# EAGLE design PiDRO1 (EAGLE 6.5.0)
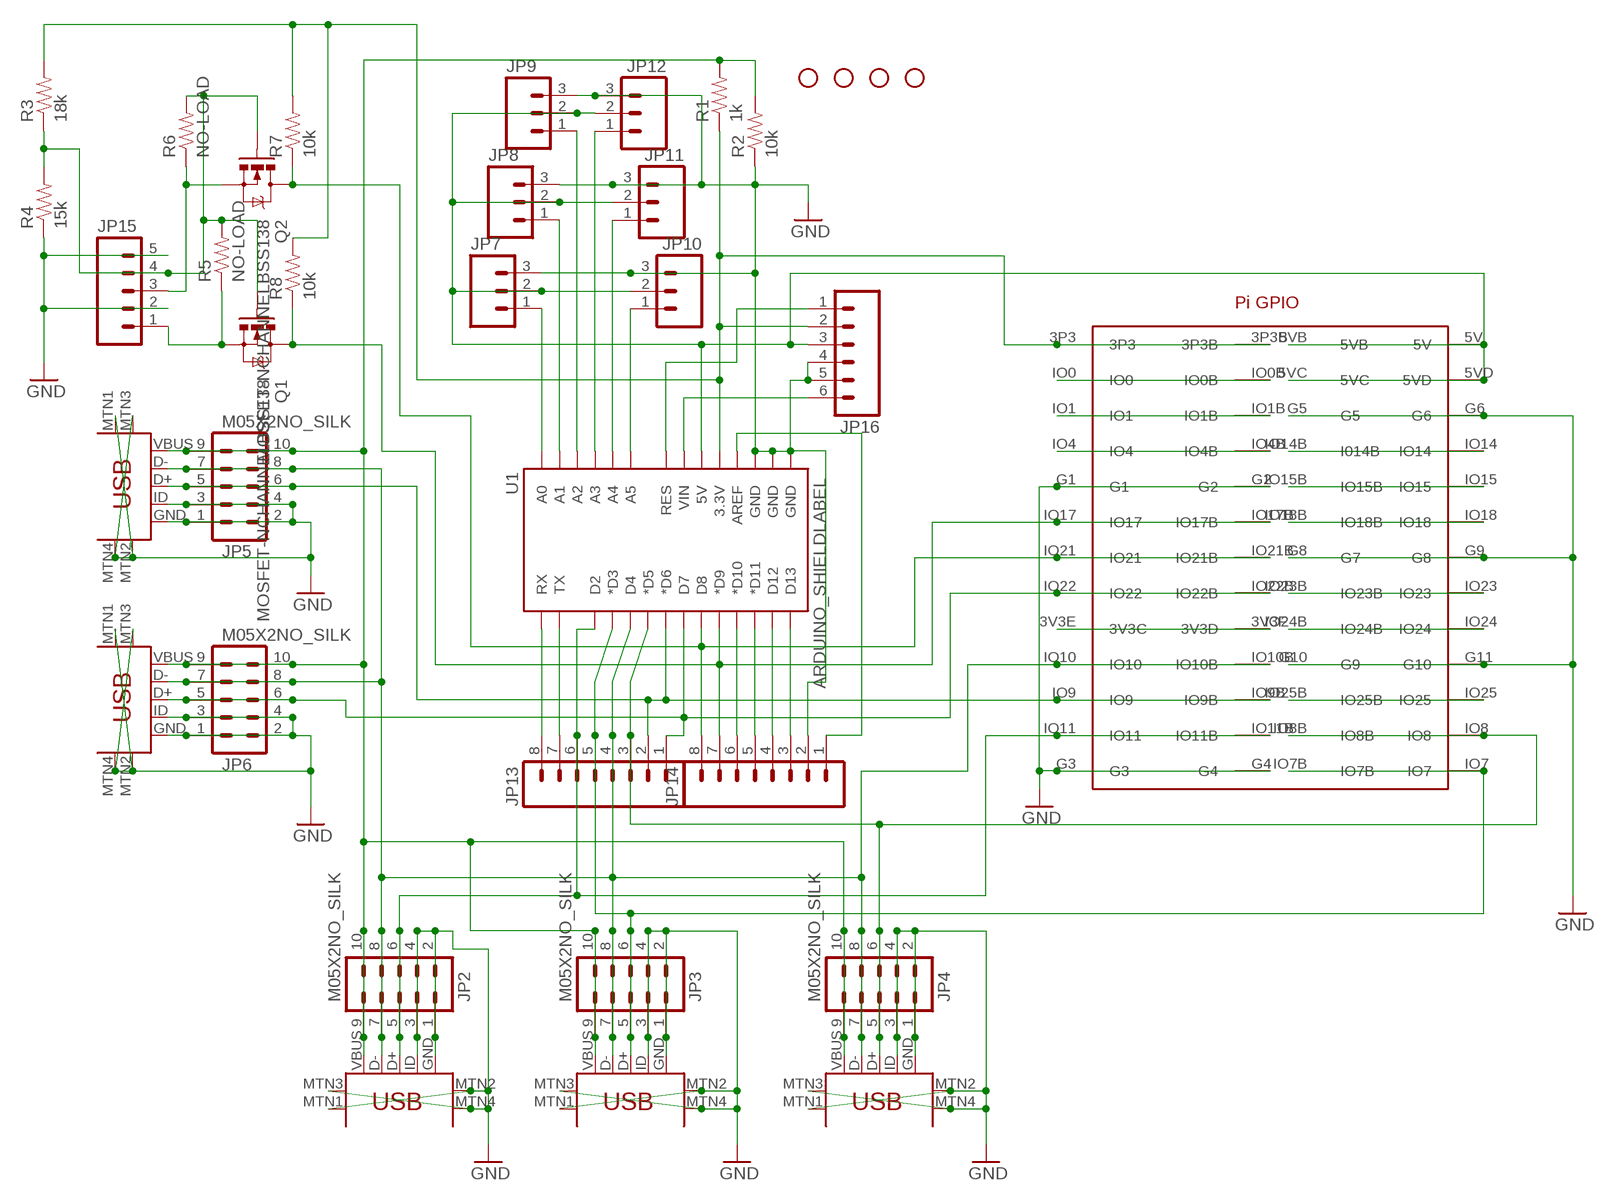
[diagram p0: schematic, sheet 1]

## Parts
JP2  M05X2NO_SILK  [2X5_NOSILK]
JP3  M05X2NO_SILK  [2X5_NOSILK]
JP4  M05X2NO_SILK  [2X5_NOSILK]
JP5  M05X2NO_SILK  [2X5_NOSILK]
JP6  M05X2NO_SILK  [2X5_NOSILK]
JP7  M03LOCK_NO_SILK  [1X03_LOCK_NO_SILK]
JP8  M03LOCK_NO_SILK  [1X03_LOCK_NO_SILK]
JP9  M03LOCK_NO_SILK  [1X03_LOCK_NO_SILK]
JP10  M03LOCK_NO_SILK  [1X03_LOCK_NO_SILK]
JP11  M03LOCK_NO_SILK  [1X03_LOCK_NO_SILK]
JP12  M03LOCK_NO_SILK  [1X03_LOCK_NO_SILK]
JP13  M08  [1X08_PIN1_NO_SILK]
JP14  M08  [1X08_PIN1_NO_SILK]
JP15  M05PTH  [1X05]
JP16  M06LOCK  [1X06_LOCK]
Q1  MOSFET-NCHANNELBSS138  [SOT23]
Q2  MOSFET-NCHANNELBSS138  [SOT23]
R1  1k  RESISTOR0805-RES  [0805]
R2  10k  RESISTOR0805-RES  [0805]
R3  18k  RESISTOR0805-RES  [0805]
R4  15k  RESISTOR0805-RES  [0805]
R5  NO-LOAD  RESISTOR0805-RES  [0805]
R6  NO-LOAD  RESISTOR0805-RES  [0805]
R7  10k  RESISTOR0805-RES  [0805]
R8  10k  RESISTOR0805-RES  [0805]
STANDOFF1  STAND-OFF  [STAND-OFF]
STANDOFF2  STAND-OFF  [STAND-OFF]
STANDOFF3  STAND-OFF  [STAND-OFF]
STANDOFF4  STAND-OFF  [STAND-OFF]
U1  ARDUINO_SHIELDLABEL  [DUEMILANOVE_SHIELD]
U$1  PIGPIO_2X  [PI_GPIO_2X]
U$2  USB-MINIB-5PIN  [USB-MINIB]
U$3  USB-MINIB-5PIN  [USB-MINIB]
U$4  USB-MINIB-5PIN  [USB-MINIB]
U$5  USB-MINIB-5PIN  [USB-MINIB]
U$6  USB-MINIB-5PIN  [USB-MINIB]

## Nets
GND: JP2.1 JP2.2 JP2.3 JP2.4 JP3.1 JP3.2 JP3.3 JP3.4 JP4.1 JP4.2 JP4.3 JP4.4 JP5.1 JP5.2 JP5.3 JP5.4 JP6.1 JP6.2 JP6.3 JP6.4 JP7.3 JP8.3 JP9.3 JP10.3 JP11.3 JP12.3 JP14.2 JP15.2 JP15.5 JP16.4 JP16.5 R2.1 R4.1 U1.GND@0(GND) U1.GND@1(GND) U1.GND@2(GND) U$1.G1 U$1.G2 U$1.G3 U$1.G4 U$1.G5 U$1.G6 U$1.G8(G7) U$1.G9(G8) U$1.G10(G9) U$1.G11(G10) U$2.GND U$2.ID U$2.MTN1(MTN2) U$2.MTN2(MTN3) U$2.MTN3(MTN1) U$2.MTN4 U$3.GND U$3.ID U$3.MTN1(MTN2) U$3.MTN2(MTN3) U$3.MTN3(MTN1) U$3.MTN4 U$4.GND U$4.ID U$4.MTN1(MTN2) U$4.MTN2(MTN3) U$4.MTN3(MTN1) U$4.MTN4 U$5.GND U$5.ID U$5.MTN1(MTN2) U$5.MTN2(MTN3) U$5.MTN3(MTN1) U$5.MTN4 U$6.GND U$6.ID U$6.MTN1(MTN2) U$6.MTN2(MTN3) U$6.MTN3(MTN1) U$6.MTN4
N$1: JP15.4 Q1.1(G) Q2.1(G) R3.1 R4.2 R5.2 R6.2
N$2: JP2.7 JP2.8 JP3.7 JP3.8 JP4.7 JP4.8 JP5.7 JP5.8 JP6.7 JP6.8 JP13.4 U1.D4 U$1.IO10 U$1.IO10B U$2.D- U$3.D- U$4.D- U$5.D- U$6.D-
N$3: JP2.5 JP2.6 JP13.6 U1.D2 U$1.IO11 U$1.IO11B U$2.D+
N$4: JP13.8 U1.RX
N$5: JP15.1 Q1.2(S) R5.1
N$6: JP15.3 Q2.2(S) R6.1
N$8: JP14.8 Q2.3(D) R7.1 U1.D8 U$1.IO21 U$1.IO21B
N$9: JP13.7 U1.TX
N$10: U$1.IO0 U$1.IO0B
N$11: JP14.7 Q1.3(D) R8.1 U1.D9(*D9) U$1.IO17 U$1.IO17B
N$12: JP11.1 U1.A4
N$13: U$1.IO1 U$1.IO1B
N$14: U$1.IO4 U$1.IO4B
N$19: U$1.3V3E(3V3C) U$1.3V3F(3V3D)
N$20: JP3.5 JP3.6 JP13.5 U1.D3(*D3) U$1.IO7 U$1.IO7B U$3.D+
N$21: JP2.9 JP2.10 JP3.9 JP3.10 JP4.9 JP4.10 JP5.9 JP5.10 JP6.9 JP6.10 R1.2 R2.2 U$2.VBUS U$3.VBUS U$4.VBUS U$5.VBUS U$6.VBUS
N$23: JP6.5 JP6.6 JP13.1 U1.D7 U$1.IO22 U$1.IO22B U$6.D+
N$26: JP4.5 JP4.6 JP13.3 U1.D5(*D5) U$1.IO8 U$1.IO8B U$4.D+
N$27: JP5.5 JP5.6 JP13.2 U1.D6(*D6) U$1.IO9 U$1.IO9B U$5.D+
N$29: JP14.3 U1.D13
N$30: JP14.4 U1.D12
N$31: JP14.5 U1.D11(*D11)
N$32: JP14.6 U1.D10(*D10)
N$35: U$1.IO25 U$1.IO25B
N$36: JP7.1 U1.A0
N$38: U$1.IO24 U$1.IO24B
N$39: JP8.1 U1.A1
N$40: U$1.IO23 U$1.IO23B
N$42: JP9.1 U1.A2
N$43: JP12.1 U1.A3
N$44: JP10.1 U1.A5
N$45: JP7.2 JP8.2 JP9.2 JP10.2 JP11.2 JP12.2 JP16.3 U1.5V U$1.5V U$1.5VB U$1.5VC U$1.5VD
N$46: JP16.2 R1.1 R3.2 R7.2 R8.2 U1.3.3V U$1.3P3 U$1.3P3B
N$47: U$1.IO18 U$1.IO18B
N$49: JP16.1 U1.RES
N$50: JP16.6 U1.VIN
N$51: JP14.1 U1.AREF
N$52: U$1.IO15 U$1.IO15B
N$53: U$1.IO14 U$1.IO14B(I014B)

## Library data of the parts
JP2-JP6 = SparkFun-Connectors:M05X2: Header 5x2 Standard 10-pin dual row 0.1" header. Commonly used with AVR-ISP. Use with Spark Fun Electronics SKU: PRT-00778
JP7-JP12 = SparkFun-Connectors:M03: Header 3 Standard 3-pin 0.1" header. Use with straight break away headers (SKU : PRT-00116), right angle break away headers (PRT-00553), swiss pins (PRT-00743), machine pins (PRT-00117), and female headers (PRT-00115). Molex polarized connector foot print use with SKU : PRT-08232 with associated crimp pins and housings.
JP13 JP14 = SparkFun-Connectors:M08: Header 8 Standard 8-pin 0.1" header. Use with straight break away headers (SKU : PRT-00116), right angle break away headers (PRT-00553), swiss pins (PRT-00743), machine pins (PRT-00117), and female headers (PRT-00115).
JP15 = SparkFun-Connectors:M05: Header 5 Standard 5-pin 0.1" header. Use with straight break away headers (SKU : PRT-00116), right angle break away headers (PRT-00553), swiss pins (PRT-00743), machine pins (PRT-00117), and female headers (PRT-00115). Molex polarized connector foot print use with SKU : PRT-08230 with associated crimp pins and housings.
JP16 = SparkFun-Connectors:M06: Header 6 Standard 6-pin 0.1" header. Use with straight break away headers (SKU : PRT-00116), right angle break away headers (PRT-00553), swiss pins (PRT-00743), machine pins (PRT-00117), and female headers (PRT-00115). Molex polarized connector foot print use with SKU : PRT-08094 with associated crimp pins and housings. NOTES ON THE VARIANTS LOCK and LOCK_LONGPADS... This footprint was designed to help hold the alignment of a through-hole component (i.e. 6-pin header) while soldering it into place. You may notice that each hole has been shifted either up or down by 0.005 of an inch from it's more standard position (which is a perfectly straight line). This slight alteration caused the pins (the squares in the middle) to touch the edges of the holes. Because they are alternating, it causes a "brace" to hold the component in place. 0.005 has proven to be the perfect amount of "off-center" position when using our standard breakaway headers. Although looks a little odd when you look at the bare footprint, once you have a header in there, the alteration is very hard to notice. Also,if you push a header all the way into place, it is covered up entirely on the bottom side. This idea of altering the position of holes to aid alignment will be further integrated into the Sparkfun Library for other footprints. It can help hold any component with 3 or more connection pins.
Q1 Q2 = SparkFun-DiscreteSemi:MOSFET-NCHANNEL: Common NMOSFET Parts MFG P/N Store ID Prod ID FDD8780 TRANS-09984 SI7820DN TRANS-11055 FDS6630A IC-08089 2N7002PW TRANS-11151 FQP30N06L COM-10213 TRANS-10060 BSS123LT1G TRANS-08345 BSS138 TRANS-00830 BS170 2N7000; PROD_ID: TRANS-00830
R1-R8 = SparkFun-Passives:RESISTOR: Resistor Basic schematic elements and footprints for 0603, 1206, and PTH resistors.
STANDOFF1-STANDOFF4 = SparkFun-Electromechanical:STAND-OFF: #4 Stand Off This is the mechanical footprint for a #4 phillips button head screw. Use the keepout ring to avoid running the screw head into surrounding components. SKU : PRT-00447
U1 = SparkFun-Boards:ARDUINO_SHIELD: Arduino shield footprint
U$1 = abc_alan:PIGPIO_2X
U$2-U$6 = SparkFun-Connectors:USB-MINIB: Mini-USB "B" connector with 5th pin broken out. Created new symbol breaking out 5th "ID" pin in mini/micro USB connector spec. See: http://en.wikipedia.org/wiki/Mini_usb#Cables. Uses same footprint as 4-pin symbol. Also added pins to connect to mounting / shield pads if required (probably not generally needed as signals aren't shielded once they leave the connector).

## Board
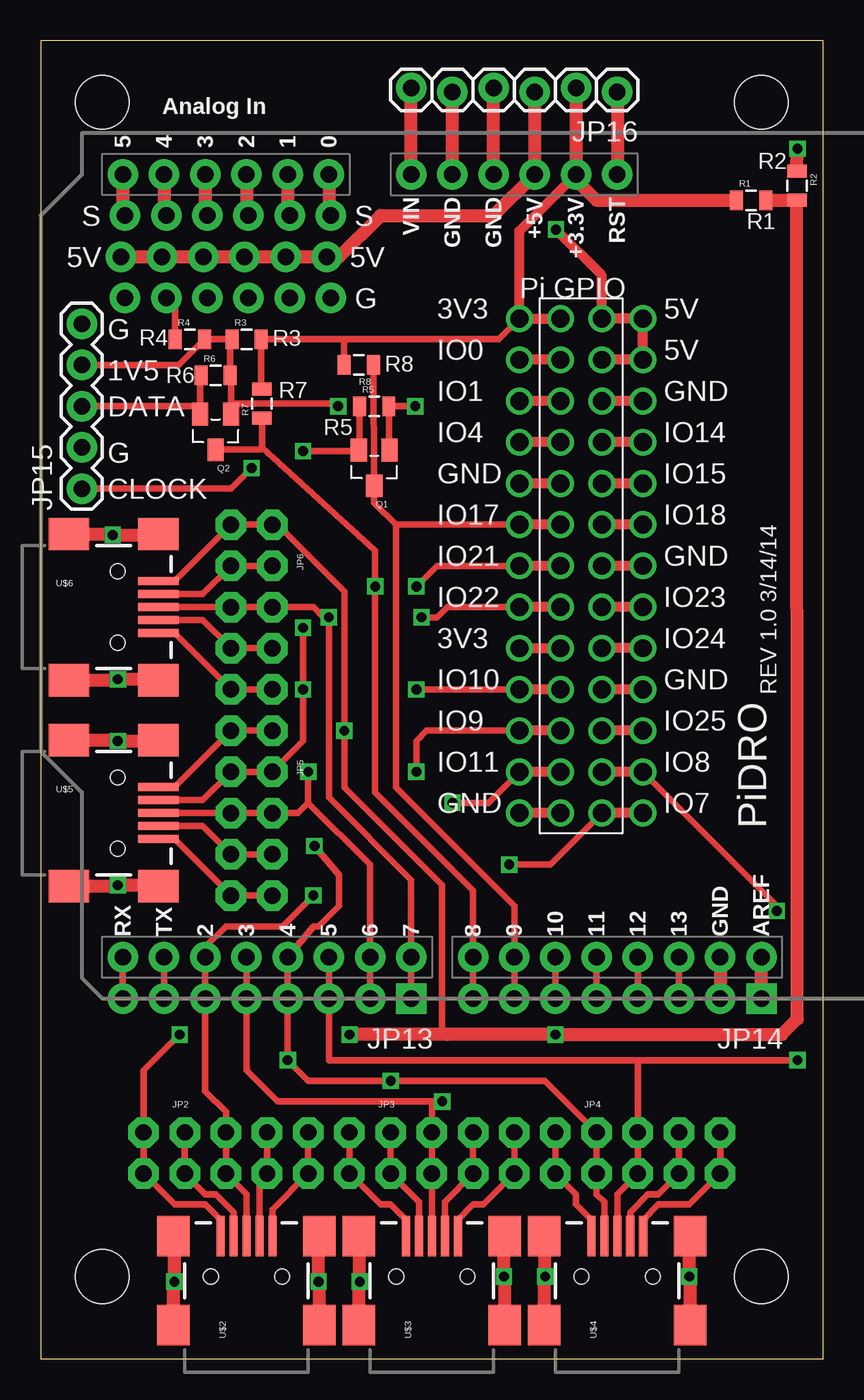
[diagram p1: board, top side]
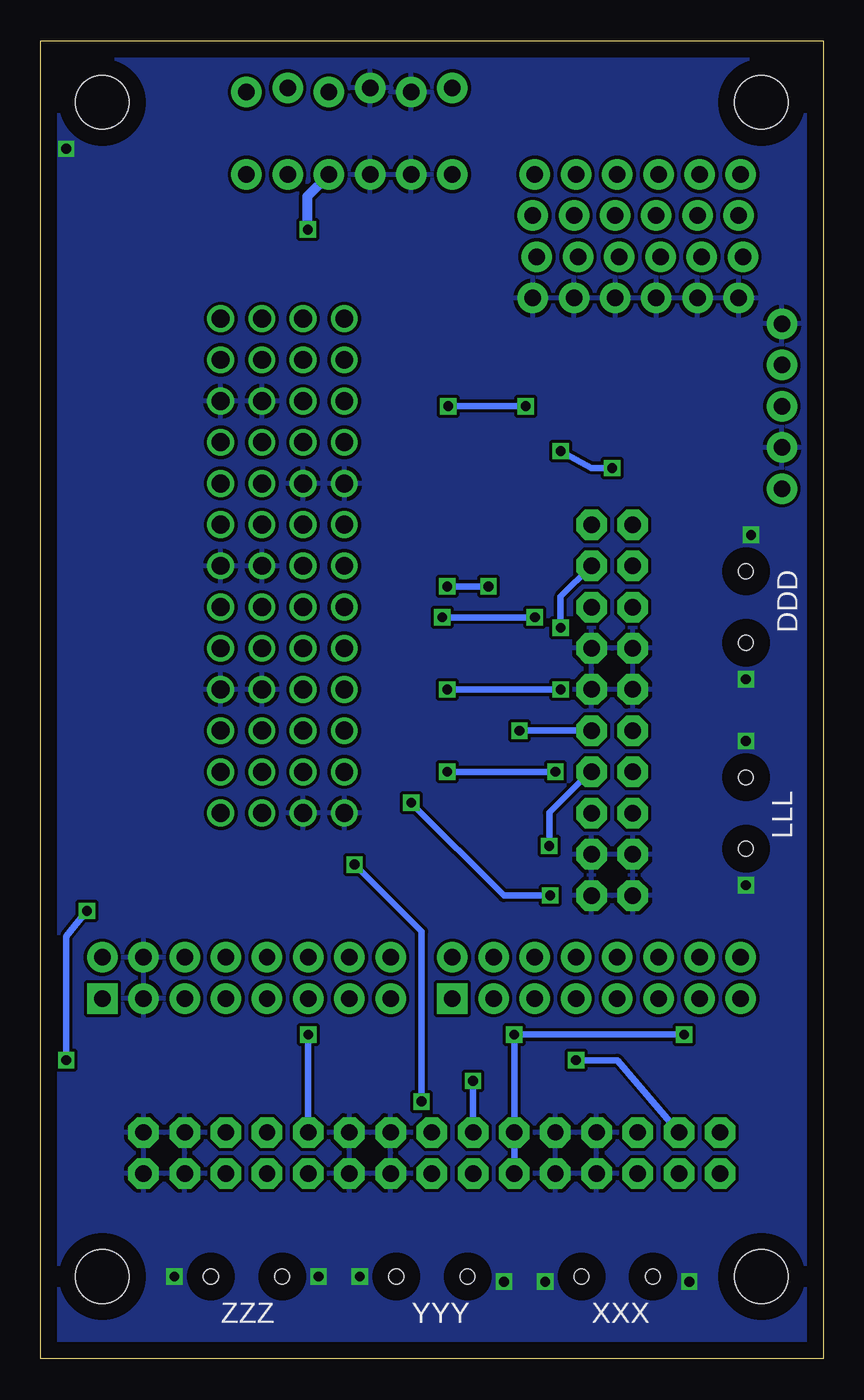
[diagram p2: board, bottom side, seen from below]

Size 48.26 x 81.28 mm. Coordinates in mm from the lower left corner, seen from the top.
Outline: 0,0 48.26,0 48.26,81.28 0,81.28 0,0
Copper layers (1*16): Top 0.035mm / dielectric 1.5mm / Bottom 0.035mm
Design rules "default *": minimum track width 10mil, minimum drill 12mil, track to track 8mil, track to pad 8mil, pad to pad 8mil, via to via 8mil, smd to smd 8mil, copper to edge 40mil, drill to drill 8mil, minimum pad ring 10mil, minimum via ring 8mil, stop-mask expansion 4mil, vias tented up to drill 0mil, thermal gap 10mil

### Footprints (pad centres in the part's own frame; a part is rotated, then mirrored left to right if it is on the bottom)
2X5_NOSILK = drill 1.016 pad 1.88 octagon: 1 -1.27,5.08; 2 1.27,5.08; 3 -1.27,2.54; 4 1.27,2.54; 5 -1.27,0; 6 1.27,0; 7 -1.27,-2.54; 8 1.27,-2.54; 9 -1.27,-5.08; 10 1.27,-5.08
1X03_LOCK_NO_SILK = drill 1.016 pad 1.88: 1 0,0.127; 2 2.54,-0.127; 3 5.08,0.127
1X08_PIN1_NO_SILK = drill 1.016 pad 1.88 square: 1 0,0 | drill 1.016 pad 1.88: 2 2.54,0; 3 5.08,0; 4 7.62,0; 5 10.16,0; 6 12.7,0; 7 15.24,0; 8 17.78,0
1X05 = drill 1.016 pad 1.88: 1 0,0; 2 2.54,0; 3 5.08,0; 4 7.62,0; 5 10.16,0
1X06_LOCK = drill 1.016 pad 1.88: 1 0,0; 2 2.54,-0.254; 3 5.08,0; 4 7.62,-0.254; 5 10.16,0; 6 12.7,-0.254
SOT23 = smd 1 x 1.4: 1 -0.95,-1.1; 2 0.95,-1.1; 3 0,1.1
0805 = smd 0.8 x 1.2: 1 -0.9,0; 2 0.9,0
STAND-OFF = hole 3.302: 0,0
DUEMILANOVE_SHIELD = drill 1.016 pad 1.88: 3.3V 50.8,26.67; 5V 50.8,29.21; A0 50.8,41.91; A1 50.8,44.45; A2 50.8,46.99; A3 50.8,49.53; A4 50.8,52.07; A5 50.8,54.61; AREF 2.54,15.24; D2 2.54,49.53; D3 2.54,46.99; D4 2.54,44.45; D5 2.54,41.91; D6 2.54,39.37; D7 2.54,36.83; D8 2.54,33.02; D9 2.54,30.48; D10 2.54,27.94; D11 2.54,25.4; D12 2.54,22.86; D13 2.54,20.32; GND@0 50.8,31.75; GND@1 50.8,34.29; GND@2 2.54,17.78; RES 50.8,24.13; RX 2.54,54.61; TX 2.54,52.07; VIN 50.8,36.83
PI_GPIO_2X = drill 1.1: 3P3 -3.81,12.7; 3P3B -1.27,12.7; 3V3E -3.81,-7.62; 3V3F -1.27,-7.62; 5V 1.27,12.7; 5VB 3.81,12.7; 5VC 1.27,10.16; 5VD 3.81,10.16; G1 1.27,7.62; G2 3.81,7.62; G3 -3.81,2.54; G4 -1.27,2.54; G5 1.27,-2.54; G6 3.81,-2.54; G8 1.27,-10.16; G9 3.81,-10.16; G10 -3.81,-17.78; G11 -1.27,-17.78; IO0 -3.81,10.16; IO0B -1.27,10.16; IO1 -3.81,7.62; IO1B -1.27,7.62; IO4 -3.81,5.08; IO4B -1.27,5.08; IO7 3.81,-17.78; IO7B 1.27,-17.78; IO8 3.81,-15.24; IO8B 1.27,-15.24; IO9 -3.81,-12.7; IO9B -1.27,-12.7; IO10 -3.81,-10.16; IO10B -1.27,-10.16; IO11 -3.81,-15.24; IO11B -1.27,-15.24; IO14 3.81,5.08; IO14B 1.27,5.08; IO15 3.81,2.54; IO15B 1.27,2.54; IO17 -3.81,0; IO17B -1.27,0; IO18 3.81,0; IO18B 1.27,0; IO21 -3.81,-2.54; IO21B -1.27,-2.54; IO22 -3.81,-5.08; IO22B -1.27,-5.08; IO23 3.81,-5.08; IO23B 1.27,-5.08; IO24 3.81,-7.62; IO24B 1.27,-7.62; IO25 3.81,-12.7; IO25B 1.27,-12.7
USB-MINIB = smd 2.5 x 0.5: D+ 2.5,0; D- 2.5,0.8; GND 2.5,-1.6; ID 2.5,-0.8; VBUS 2.5,1.6 | smd 2.5 x 2: MTN1 -3,4.5; MTN2 2.5,4.5; MTN3 -3,-4.5; MTN4 2.5,-4.5 | hole 0.9: 0,2.2; 0,-2.2

### Placement (x,y rotation side)
JP2  11.43,12.7 270 top
JP3  24.13,12.7 270 top
JP4  36.83,12.7 270 top
JP5  13.02,33.66 180 top
JP6  13.02,46.35 180 top
JP7  17.78,70.48 270 top
JP8  15.24,70.48 270 top
JP9  12.7,70.48 270 top
JP10  5.08,70.48 270 top
JP11  7.62,70.48 270 top
JP12  10.16,70.48 270 top
JP13  22.86,22.23 180 top
JP14  44.45,22.23 180 top
JP15  2.54,53.66 90 top
JP16  35.56,78.11 180 top
Q1  20.57,54.93 180 top
Q2  10.79,57.15 180 top
R1  43.81,71.44 0 top
R2  46.64,72.33 270 top
R3  12.7,62.87 0 top
R4  9.21,62.87 0 top
R5  20.57,58.74 0 top
R6  10.79,60.64 0 top
R7  13.65,58.9 90 top
R8  19.62,61.28 180 top
STANDOFF1  3.81,5.08 0 top
STANDOFF2  44.45,5.08 0 top
STANDOFF3  3.81,77.47 0 top
STANDOFF4  44.45,77.47 0 top
U1  59.69,22.23 90 top
U$1  33.34,51.44 0 top
U$2  12.7,5.08 90 top
U$3  24.13,5.08 90 top
U$4  35.56,5.08 90 top
U$5  4.76,33.66 0 top
U$6  4.76,46.35 0 top

### Tracks (layer width: path | path; a pad name or v marks a point on that pad's centre or on a via)
GND  (via drill 0.6)
  Top 0.406: U$5.ID 10.01,32.85 JP5.4 JP5.3 | JP5.1 JP5.2 8.26,32.07 7.28,32.07 U$5.GND | U$6.ID 10.01,45.55 JP6.4 JP6.3 | U$6.GND 8.27,44.76 JP6.2 JP6.1 | U$2.ID 13.5,10.96 JP2.4 JP2.3 | JP2.1 JP2.2 14.3,9.22 U$2.GND | U$3.ID 24.93,9.69 JP3.4 JP3.3 | U$3.GND 25.73,8.59 26.67,9.53 27.3,9.53 JP3.2 JP3.1 | JP4.3 JP4.4 38.1,10.16 37.47,10.16 36.36,9.05 U$4.ID | JP4.1 JP4.2 40.01,9.53 38.1,9.53 37.16,8.59 U$4.GND | 5.13,65.33 JP10.3 | R4.1 8.31,64.84 JP11.3
  Top 0.61: U$1.G6 U$1.G5 | U$1.G9 U$1.G8 | U$1.G11 U$1.G10 | U$1.G4 U$1.G3 | U$1.G2 U$1.G1
  Top 0.813: R2.1 v46.67,74.61 | U1.GND@2 JP14.2 | U$2.MTN1 8.2,4.71 v8.26,4.76 8.26,7.53 U$2.MTN2 | U$2.MTN3 17.2,4.71 v17.14,4.76 17.14,7.53 U$2.MTN4 | U$3.MTN1 19.63,4.71 v19.68,4.76 19.68,7.53 U$3.MTN2 | U$3.MTN3 28.63,5.03 v28.57,5.08 28.57,7.53 U$3.MTN4 | U$4.MTN1 31.06,5.03 v31.11,5.08 31.11,7.53 U$4.MTN2 | U$4.MTN3 40.06,5.03 v40.01,5.08 40.01,7.53 U$4.MTN4 | U$6.MTN3 4.71,41.85 v4.76,41.91 7.21,41.91 U$6.MTN4 | U$6.MTN1 4.39,50.85 v4.45,50.8 7.21,50.8 U$6.MTN2 | U$5.MTN3 4.71,29.16 v4.76,29.21 7.21,29.21 U$5.MTN4 | U$5.MTN1 4.71,38.16 v4.76,38.1 7.21,38.1 U$5.MTN2 | U1.GND@1 JP16.5 | U1.GND@0 JP16.4
  pour Bottom: 0,0 0,81.28 48.26,81.28 48.26,80.01 48.26,0
N$1  (via drill 0.6)
  Top 0.406: JP15.4 8.52,61.28 R4.2 R3.1 11.7,62.76 R6.2 11.74,60.91 11.74,58.77 | Q2.1 11.74,58.77 | v18.35,58.74 18.2,58.88 11.86,58.88 11.74,58.77 | v23.11,58.74 R5.2 21.47,56.71 Q1.1
  Bottom 0.406: v18.35,58.74 v23.11,58.74
N$2  (via drill 0.6)
  Top 0.406: U$2.D- 11.9,9.05 10.79,10.16 10.16,10.16 JP2.8 JP2.7 | JP13.4 U1.D4 | U$4.D- 34.76,9.69 34.29,10.16 JP4.8 JP4.7 31.11,17.14 v21.59,17.14 16.51,17.14 v15.24,18.41 U1.D4 | U$3.D- 23.33,9.69 JP3.8 JP3.7 | U$5.D- 10.01,34.45 JP5.8 JP5.7 16.19,38.1 v16.19,41.27 v16.19,45.09 | U$6.D- 10.01,47.16 JP6.8 JP6.7 | U1.D4 16.83,26.67 17.14,26.67 18.41,27.94 18.41,29.84 v16.89,31.62 | U$1.IO10 v23.18,41.27
  Top 0.61: U$1.IO10B U$1.IO10
  Bottom 0.406: v15.24,18.41 12.7,18.41 JP2.7 | JP3.7 v21.59,17.14 | v16.19,45.09 16.19,46.99 JP6.7 | v23.18,41.27 v16.19,41.27 | JP5.7 14.38,36.2 16.89,33.69 v16.89,31.62
N$3  (via drill 0.6)
  Top 0.406: U$2.D+ 12.7,10.16 JP2.6 JP2.5 11.43,15.24 10.16,16.51 U1.D2 | JP13.6 U1.D2 | U1.D2 10.16,25.4 11.43,26.67 14.92,26.67 v16.83,28.57 | v25.4,34.29 27.62,34.29 U$1.IO11
  Top 0.61: U$1.IO11B U$1.IO11
  Bottom 0.406: v16.83,28.57 19.68,28.57 v25.4,34.29
N$4
  Top 0.406: JP13.8 U1.RX
N$5  (via drill 0.6)
  Top 0.406: R5.1 19.67,56.71 Q1.2 19.57,55.98 v16.19,55.98 | JP15.1 11.75,53.66 v13.02,54.93
  Bottom 0.406: v13.02,54.93 14.29,54.93 v16.19,55.98
N$6
  Top 0.406: JP15.3 9.7,58.74 Q2.2 9.85,60.91 R6.1
N$8  (via drill 0.6)
  Top 0.406: Q2.3 13.51,56.05 13.65,56.2 | JP14.8 U1.D8 26.67,28.89 20.64,34.92 v20.64,47.62 | 20.64,47.68 v20.64,47.62 | v23.18,47.62 24.45,48.9 U$1.IO21 | R7.1 13.65,56.2 | 13.65,56.2 20.64,49.85 v20.64,47.62
  Top 0.61: U$1.IO21B U$1.IO21
  Bottom 0.406: v20.64,47.62 v23.18,47.62
N$9
  Top 0.406: JP13.7 U1.TX
N$10
  Top 0.61: U$1.IO0B U$1.IO0
N$11
  Top 0.406: R8.1 Q1.3 20.57,52.78 21.91,51.45 | JP14.7 U1.D9 29.21,27.94 21.91,35.24 21.91,51.45 | U$1.IO17 22.37,51.44 21.91,51.45
  Top 0.61: U$1.IO17B U$1.IO17
N$12
  Top 0.813: U1.A4 7.62,70.61 JP11.1
N$13
  Top 0.61: U$1.IO1B U$1.IO1
N$14
  Top 0.61: U$1.IO4B U$1.IO4
N$19
  Top 0.61: U$1.3V3E U$1.3V3F
N$20  (via drill 0.6)
  Top 0.406: U$3.D+ JP3.6 JP3.5 24.13,15.88 | 24.13,15.88 14.61,15.88 12.7,17.78 U1.D3 | U1.D3 JP13.5 | U1.D3 12.7,25.08 | 24.13,15.88 v24.77,15.88 | v28.89,30.48 31.43,30.48 U$1.IO7B
  Top 0.61: U$1.IO7 U$1.IO7B
  Bottom 0.406: v24.77,15.88 24.77,26.35 v28.89,30.48
N$21  (via drill 0.6)
  Top 0.406: U$4.VBUS 33.96,8.59 33.02,9.53 33.02,10.16 JP4.10 JP4.9 | U$3.VBUS 22.53,8.59 21.59,9.53 20.95,9.53 JP3.10 JP3.9 | U$2.VBUS 11.1,8.59 10.16,9.53 8.26,9.53 JP2.10 JP2.9 6.35,17.78 v8.57,20 | U$5.VBUS 8.27,35.26 JP5.10 JP5.9 | U$6.VBUS 8.27,47.95 JP6.10 JP6.9 14.61,51.44 18.73,47.31 v18.73,38.73 18.73,35.24 24.77,29.21 24.77,20.32 25.08,20
  Top 0.813: R1.2 R2.2 46.67,20.95 45.72,20 v31.75,20 25.08,20 v19.05,20
  Bottom 0.406: JP4.9 v31.75,20 | JP3.10 v19.05,20 v8.57,20 | v18.73,38.73 JP5.9
N$23  (via drill 0.6)
  Top 0.406: U$6.D+ JP6.6 JP6.5 16.83,46.35 17.46,45.72 v17.78,45.72 17.78,34.61 22.86,29.53 U1.D7 JP13.1 | v23.5,45.72 24.45,45.72 25.08,46.35 U$1.IO22
  Top 0.61: U$1.IO22B U$1.IO22
  Bottom 0.406: v17.78,45.72 v23.5,45.72
N$26  (via drill 0.6)
  Top 0.406: U$4.D+ 35.56,10.16 JP4.6 JP4.5 36.83,18.41 | U1.D5 JP13.3 17.78,18.41 36.83,18.41 | 36.83,18.41 v46.67,18.41 | v45.4,27.62 45.72,27.62 U$1.IO8
  Top 0.61: U$1.IO8 U$1.IO8B
  Bottom 0.406: v46.67,18.41 46.67,26.04 v45.4,27.62
N$27  (via drill 0.6)
  Top 0.406: U$5.D+ JP5.6 JP5.5 15.88,33.66 16.51,34.29 | JP13.2 U1.D6 20.32,30.48 16.51,34.29 | v16.51,36.2 16.51,34.29 | v23.18,36.2 23.18,38.1 23.81,38.73 U$1.IO9
  Top 0.61: U$1.IO9B U$1.IO9
  Bottom 0.406: v23.18,36.2 v16.51,36.2
N$29
  Top 0.406: JP14.3 U1.D13
N$30
  Top 0.406: JP14.4 U1.D12
N$31
  Top 0.406: JP14.5 U1.D11
N$32
  Top 0.406: JP14.6 U1.D10
N$35
  Top 0.61: U$1.IO25 U$1.IO25B
N$36
  Top 0.813: U1.A0 17.78,70.61 JP7.1
N$38
  Top 0.61: U$1.IO24 U$1.IO24B
N$39
  Top 0.813: U1.A1 15.24,70.61 JP8.1
N$40
  Top 0.61: U$1.IO23 U$1.IO23B
N$42
  Top 0.813: U1.A2 12.7,70.61 JP9.1
N$43
  Top 0.813: U1.A3 10.16,70.61 JP12.1
N$44
  Top 0.813: U1.A5 5.08,70.61 JP10.1
N$45  (via drill 0.6)
  Top 0.61: U$1.5VC U$1.5VD U$1.5VB U$1.5V 34.61,66.8 v31.78,69.63
  Top 0.813: JP10.2 JP11.2 JP12.2 JP9.2 JP8.2 JP7.2 18.41,67.94 20.95,70.48 27.94,70.48 U1.5V JP16.3
  Bottom 0.61: U1.5V 30.48,72.99 31.81,71.66 31.81,69.66 v31.78,69.63
N$46
  Top 0.406: 18.7,62.87 R3.2 13.6,59.69 R7.2 | R8.2 18.7,62.87 | 18.7,62.87 28.26,62.87 U$1.3P3
  Top 0.61: U$1.3P3B U$1.3P3 29.53,69.53 U1.3.3V
  Top 0.813: R1.1 34.29,71.44 33.02,72.71 U1.3.3V JP16.2
N$47
  Top 0.61: U$1.IO18 U$1.IO18B
N$49
  Top 0.813: JP16.1 U1.RES
N$50
  Top 0.813: U1.VIN JP16.6
N$51
  Top 0.813: JP14.1 U1.AREF
N$52
  Top 0.61: U$1.IO15 U$1.IO15B
N$53
  Top 0.61: U$1.IO14 U$1.IO14B

### Text on the board
tPlace: R2 | S | S | R1 | 5V | 5V | G | G | R4 | R3 | R8 | 1V5 | R6 | R7 | DATA | R5 | G | CLOCK | REV 1.0 3/14/14 | PiDRO
bPlace: DDD | LLL | XXX | YYY | ZZZ